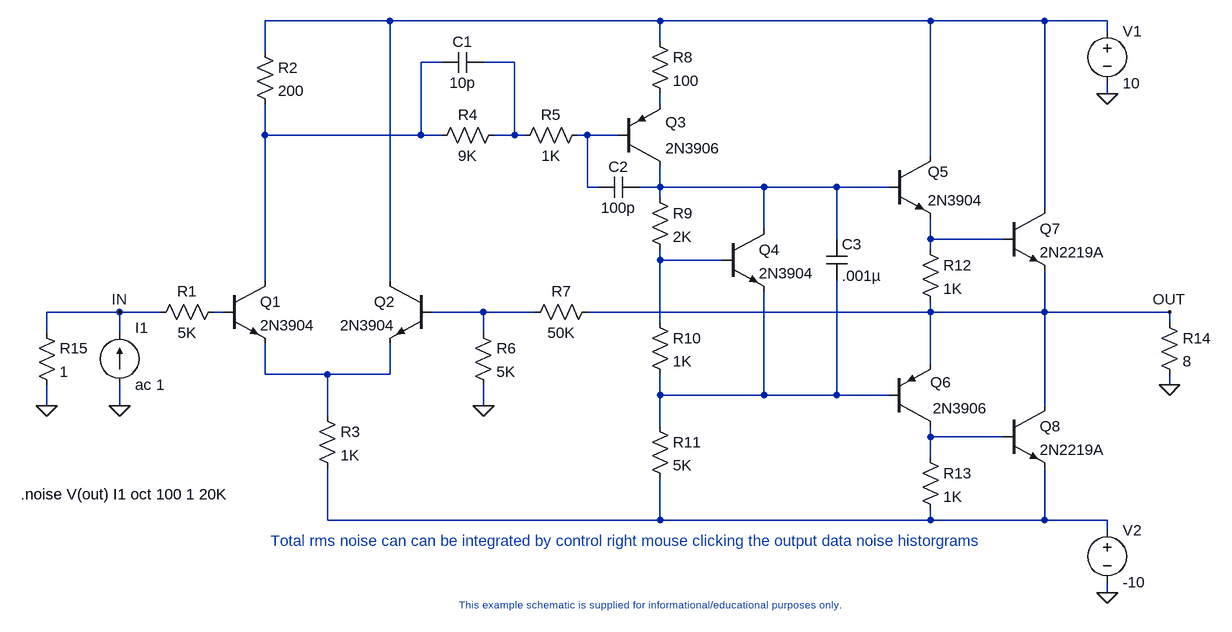
[diagram p0: schematic n2.asc]
n2.asc, the LTspice schematic file:
Version 4
SHEET 1 2352 1912
WIRE 976 912 784 912
WIRE 1392 912 976 912
WIRE 1808 912 1392 912
WIRE 1984 912 1808 912
WIRE 2080 912 1984 912
WIRE 2080 928 2080 912
WIRE 1392 944 1392 912
WIRE 784 960 784 912
WIRE 1056 976 1024 976
WIRE 1168 976 1120 976
WIRE 2080 1024 2080 1008
WIRE 1392 1040 1392 1024
WIRE 784 1088 784 1040
WIRE 1024 1088 1024 976
WIRE 1024 1088 784 1088
WIRE 1056 1088 1024 1088
WIRE 1168 1088 1168 976
WIRE 1168 1088 1136 1088
WIRE 1184 1088 1168 1088
WIRE 1280 1088 1264 1088
WIRE 1328 1088 1280 1088
WIRE 1808 1120 1808 912
WIRE 1280 1168 1280 1088
WIRE 1296 1168 1280 1168
WIRE 1392 1168 1392 1136
WIRE 1392 1168 1360 1168
WIRE 1552 1168 1392 1168
WIRE 1664 1168 1552 1168
WIRE 1744 1168 1664 1168
WIRE 1392 1184 1392 1168
WIRE 1984 1200 1984 912
WIRE 1552 1232 1552 1168
WIRE 1664 1248 1664 1168
WIRE 1808 1248 1808 1216
WIRE 1920 1248 1808 1248
WIRE 1808 1264 1808 1248
WIRE 1392 1280 1392 1264
WIRE 1488 1280 1392 1280
WIRE 784 1312 784 1088
WIRE 976 1312 976 912
WIRE 560 1360 448 1360
WIRE 624 1360 560 1360
WIRE 720 1360 704 1360
WIRE 1120 1360 1040 1360
WIRE 1200 1360 1120 1360
WIRE 1808 1360 1808 1344
WIRE 1808 1360 1280 1360
WIRE 1984 1360 1984 1296
WIRE 1984 1360 1808 1360
WIRE 2176 1360 1984 1360
WIRE 1392 1376 1392 1280
WIRE 2176 1376 2176 1360
WIRE 448 1392 448 1360
WIRE 560 1392 560 1360
WIRE 1120 1392 1120 1360
WIRE 1808 1440 1808 1360
WIRE 784 1456 784 1408
WIRE 880 1456 784 1456
WIRE 976 1456 976 1408
WIRE 976 1456 880 1456
WIRE 2176 1472 2176 1456
WIRE 1392 1488 1392 1456
WIRE 1552 1488 1552 1328
WIRE 1552 1488 1392 1488
WIRE 1664 1488 1664 1312
WIRE 1664 1488 1552 1488
WIRE 1744 1488 1664 1488
WIRE 448 1504 448 1472
WIRE 560 1504 560 1472
WIRE 1120 1504 1120 1472
WIRE 1984 1504 1984 1360
WIRE 880 1520 880 1456
WIRE 1392 1536 1392 1488
WIRE 1808 1552 1808 1536
WIRE 1920 1552 1808 1552
WIRE 1808 1584 1808 1552
WIRE 880 1680 880 1600
WIRE 1392 1680 1392 1616
WIRE 1392 1680 880 1680
WIRE 1808 1680 1808 1664
WIRE 1808 1680 1392 1680
WIRE 1984 1680 1984 1600
WIRE 1984 1680 1808 1680
WIRE 2080 1680 1984 1680
WIRE 2080 1696 2080 1680
WIRE 2080 1792 2080 1776
FLAG 2080 1024 0
FLAG 2080 1792 0
FLAG 2176 1472 0
FLAG 1120 1504 0
FLAG 560 1504 0
FLAG 560 1360 IN
FLAG 2176 1360 OUT
FLAG 448 1504 0
SYMBOL NPN 1744 1120 R0
WINDOW 0 60 24 Left 2
WINDOW 3 60 68 Left 2
SYMATTR InstName Q5
SYMATTR Value 2N3904
SYMBOL npn 1920 1200 R0
SYMATTR InstName Q7
SYMATTR Value 2N2219A
SYMBOL npn 1920 1504 R0
SYMATTR InstName Q8
SYMATTR Value 2N2219A
SYMBOL PNP 1744 1536 M180
WINDOW 0 64 68 Left 2
WINDOW 3 68 28 Left 2
SYMATTR InstName Q6
SYMATTR Value 2N3906
SYMBOL VOLTAGE 2080 912 R0
SYMATTR InstName V1
SYMATTR Value 10
SYMBOL voltage 2080 1680 R0
SYMATTR InstName V2
SYMATTR Value -10
SYMBOL RES 1376 1520 R0
SYMATTR InstName R11
SYMATTR Value 5K
SYMBOL res 2160 1360 R0
SYMATTR InstName R14
SYMATTR Value 8
SYMBOL res 1376 1168 R0
SYMATTR InstName R9
SYMATTR Value 2K
SYMBOL res 1376 1360 R0
SYMATTR InstName R10
SYMATTR Value 1K
SYMBOL npn 1488 1232 R0
SYMATTR InstName Q4
SYMATTR Value 2N3904
SYMBOL npn 720 1312 R0
SYMATTR InstName Q1
SYMATTR Value 2N3904
SYMBOL npn 1040 1312 M0
SYMATTR InstName Q2
SYMATTR Value 2N3904
SYMBOL res 768 944 R0
SYMATTR InstName R2
SYMATTR Value 200
SYMBOL res 864 1504 R0
SYMATTR InstName R3
SYMATTR Value 1K
SYMBOL pnp 1328 1136 M180
WINDOW 0 72 68 Left 2
WINDOW 3 72 28 Left 2
SYMATTR InstName Q3
SYMATTR Value 2N3906
SYMBOL res 1104 1376 R0
SYMATTR InstName R6
SYMATTR Value 5K
SYMBOL res 1296 1344 R90
WINDOW 0 0 56 VBottom 2
WINDOW 3 32 56 VTop 2
SYMATTR InstName R7
SYMATTR Value 50K
SYMBOL res 720 1344 R90
WINDOW 0 0 56 VBottom 2
WINDOW 3 32 56 VTop 2
SYMATTR InstName R1
SYMATTR Value 5K
SYMBOL res 1376 928 R0
SYMATTR InstName R8
SYMATTR Value 100
SYMBOL res 1152 1072 R90
WINDOW 0 0 56 VBottom 2
WINDOW 3 32 56 VTop 2
SYMATTR InstName R4
SYMATTR Value 9K
SYMBOL cap 1360 1152 R90
WINDOW 0 0 32 VBottom 2
WINDOW 3 32 32 VTop 2
SYMATTR InstName C2
SYMATTR Value 100p
SYMBOL cap 1120 960 R90
WINDOW 0 0 32 VBottom 2
WINDOW 3 32 32 VTop 2
SYMATTR InstName C1
SYMATTR Value 10p
SYMBOL res 1792 1568 R0
SYMATTR InstName R13
SYMATTR Value 1K
SYMBOL res 1792 1248 R0
SYMATTR InstName R12
SYMATTR Value 1K
SYMBOL cap 1648 1248 R0
SYMATTR InstName C3
SYMATTR Value .001µ
SYMBOL res 1280 1072 R90
WINDOW 0 0 56 VBottom 2
WINDOW 3 32 56 VTop 2
SYMATTR InstName R5
SYMATTR Value 1K
SYMBOL current 560 1472 M180
WINDOW 0 24 88 Left 2
WINDOW 3 24 0 Left 2
SYMATTR InstName I1
SYMATTR Value ac 1
SYMBOL res 432 1376 R0
SYMATTR InstName R15
SYMATTR Value 1
TEXT 1368 1800 Top 1 ;This example schematic is supplied for informational/educational purposes only.
TEXT 408 1640 Left 2 !.noise V(out) I1 oct 100 1 20K
TEXT 1344 1696 Top 2 ;Total rms noise can can be integrated by control right mouse clicking the output data noise historgrams

The netlist it stands for:
* n2.asc
Q5 N001 N006 N007 0 2N3904
Q7 N001 N007 OUT 0 2N2219A
Q8 OUT N013 N014 0 2N2219A
Q6 N013 N012 OUT 0 2N3906
V1 N001 0 10
V2 N014 0 -10
R11 N012 N014 5K
R14 OUT 0 8
R9 N006 N008 2K
R10 N008 N012 1K
Q4 N006 N008 N012 0 2N3904
Q1 N002 N009 N011 0 2N3904
Q2 N001 N010 N011 0 2N3904
R2 N001 N002 200
R3 N011 N014 1K
Q3 N006 N005 N004 0 2N3906
R6 N010 0 5K
R7 OUT N010 50K
R1 N009 IN 5K
R8 N001 N004 100
R4 N003 N002 9K
C2 N006 N005 100p
C1 N003 N002 10p
R13 N013 N014 1K
R12 N007 OUT 1K
C3 N006 N012 .001µ
R5 N005 N003 1K
I1 0 IN ac 1
R15 IN 0 1
.model NPN NPN
.model PNP PNP
.lib standard.bjt
* This example schematic is supplied for informational/educational purposes only.
.noise V(out) I1 oct 100 1 20K
* Total rms noise can can be integrated by control right mouse clicking the output data noise historgrams
.backanno
.end